# EAGLE design OLED(64x32) (EAGLE 6.5.0)
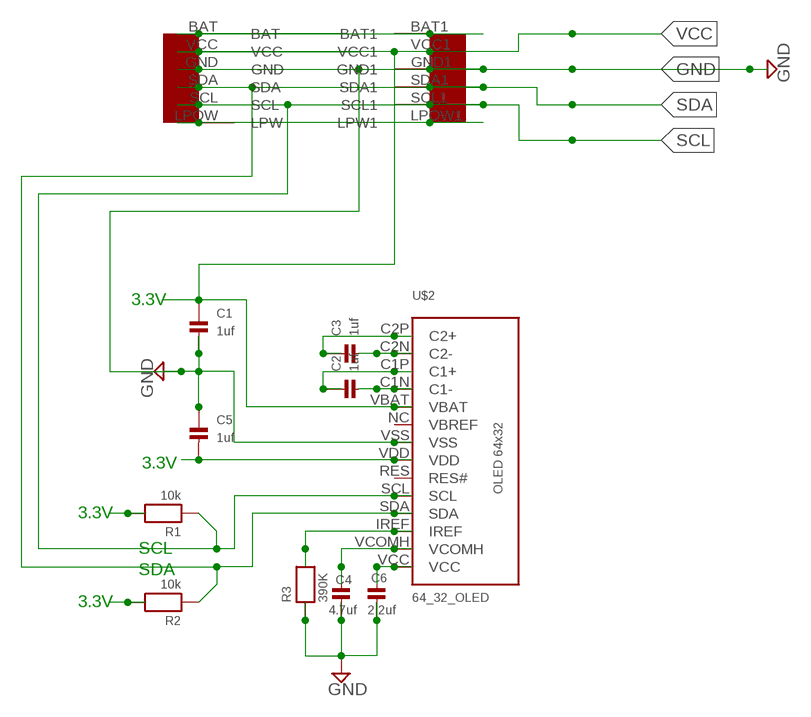
[diagram p0: schematic, sheet 1]

## Parts
C1  1uf  CAP_CERAMIC0603  [0603]
C2  1uf  CAP_CERAMIC0603  [0603]
C3  1uf  CAP_CERAMIC0603  [0603]
C4  4.7uf  CAP_CERAMIC0603  [0603]
C5  1uf  CAP_CERAMIC0603  [0603]
C6  2.2uf  CAP_CERAMIC0603  [0603]
R1  10k  RESISTOR0603  [0603]
R2  10k  RESISTOR0603  [0603]
R3  390K  RESISTOR0603  [0603]
U$1  EASYI2C6PINHEADERBLE_VERSION  [EASYI2C6HEADERBLE]
U$2  64_32_OLED  [64_32_OLED]

## Nets
BAT: U$1.BAT U$1.BAT1
GND: C1.2 C4.2 C5.1 C6.2 R3.1 U$1.GND U$1.GND1 U$2.VSS
LPW: U$1.LPOW1(LPW1) U$1.LPOW(LPW)
N$2: C2.2 U$2.C1N(C1-)
N$3: C2.1 U$2.C1P(C1+)
N$4: C3.2 U$2.C2N(C2-)
N$5: C3.1 U$2.C2P(C2+)
N$6: R3.2 U$2.IREF
N$7: C4.1 U$2.VCOMH
N$8: C6.1 U$2.VCC
SCL: R1.1 U$1.SCL U$1.SCL1 U$2.SCL
SDA: R2.1 U$1.SDA U$1.SDA1 U$2.SDA
VCC: C1.1 C5.2 R1.2 R2.2 U$1.VCC U$1.VCC1 U$2.VBAT U$2.VDD
Unconnected: U$2.NC(VBREF) U$2.RES(RES#)

## Notes on the sheet
- 3.3V
- 3.3V
- 3.3V
- SCL
- SDA
- 3.3V

## Library data of the parts
C1-C6 = microbuilder:CAP_CERAMIC: Ceramic Capacitors 0402 - 0402 Surface Mount Capacitors 16pF 50V 5% [Digikey: 445-4899-2-ND] 18pF 50V 5% [Digikey: 490-1281-2-ND] 22pF 50V 5% [Digikey: 490-1283-2-ND] 68pF 50V 5% [Digikey: 490-1289-2-ND] 0.1uF 10V 10% [Digikey: 490-1318-2-ND] 1.0uF 6.3V 10% [Digikey: 490-1320-2-ND] 0603 - 0603 Surface Mount Capacitors 16 pF 50V 5% [Digikey: 445-5051-2-ND] 22 pF 50V [Digikey: PCC220ACVTR-ND] 33 pF 50V 5% [Digikey: 490-1415-1-ND] 56pF 50V 5% [Digikey: 490-1421-1-ND] 220pF 50V 5% [Digikey: 445-1285-1-ND] 680 pF 50V 2200 pF 50V 5% C0G [Digikey: 445-1297-1-ND] 5600 pF 100V 5% X7R [Digikey: 478-3711-1-ND] 0.1 µF 25V 10% [Digikey: PCC2277TR-ND] 0.22 µF 16V 10% X7R [Digikey: 445-1318-1-ND] 1.0 µF 25V 10% [Digikey: 445-5146-2-ND] 0603 - RF Specific 3pF 250V +/-0.1pF RF [Digikey: 712-1347-1-ND] 18 pF 250V 5% [Digikey: 478-3505-1-ND or 712-1322-1-ND] 56 pF 250V 5% C0G RF [Digikey: 490-4867-1-ND] 68 pF 250V RF [Digikey: 490-4868-1-ND] 0805 - 0805 Surface Mount Capacitors 220 pF 250V 2% RF Ceramic Capacitor [Digikey: 712-1398-1-ND] 1000 pF 50V 2% NP0 Ceramic Capacitor [Digikey: 478-3760-1-ND] 0.1 µF 25V 10% Ceramic Capacitor [Digikey: PCC1828TR-ND] 1.0 µF 16V 10% Ceramic Capacitor[Digikey: 490-1691-2-ND] 10.0 µF 10V 10% Ceramic Capacitor[Digikey: 709-1228-1-ND] 10.0 uF 16V 10% Ceramic Capacitor [Digikey: 478-5165-2-ND] 47 uF 6.3V 20% Ceramic Capacitor [Digikey: 587-1779-1-ND or 399-5506-1-ND] 1206 - 1206 Surface Mount Capacitors 47uF 10V 20% Ceramic Capacitor [Digikey: 490-5528-1-ND or 399-5508-1-ND or 445-6010-1-ND] 100uF 6.3V -20%, +80% Y5V Ceramic Capacitor (Digikey: 490-4512-1-ND, Mouser: 81-GRM31CF50J107ZE1L)
R1-R3 = microbuilder:RESISTOR: Resistors 0402 - 0402 Surface Mount Package 22 Ohm 1% 1/16W [Digikey: 311-22.0LRTR-ND] 33 Ohm 5% 1/16W 1.0K 5% 1/16W 1.5K 5% 1/16W 2.0K 1% 1/16W 10.0K 1% 1/16W [Digikey: 311-10.0KLRTR-ND] 10.0K 5% 1/16W [Digikey: RMCF0402JT10K0TR-ND] 12.1K 1% 1/16W [Digikey: 311-22.0LRTR-ND] 100.0K 5% 1/16W 0603 - 0603 Surface Mount Package 0 Ohm 1/10 Watt 1% Resistor 15 Ohm 1/10 Watt 1% Resistor 33 Ohm 1/10 Watt 1% Resistor 49.9 Ohm 1/10 Watt 1% Resistor 100 Ohm 1/10 Watt 1% Resistor 150 Ohm 1/10 Watt 1% Resistor 240 Ohm 1/10 Watt 1% Resistor 390 Ohm 1/10 Watt 1% Resistor 560 Ohm 1/10 Watt 1% Resistor 680 Ohm 1/10 Watt 1% Resistor 750 Ohm 1/10 Watt 1% Resistor 1.0K Ohm 1/10 Watt 1% Resistor 1.5K Ohm 1/10 Watt 1% Resistor 2.0K Ohm 1/10 Watt 1% Resistor 2.2K Ohm 1/10 Watt 1% Resistor 3.3K Ohm 1/10 Watt 1% Resistor 4.7K Ohm 1/10 Watt 1% Resistor 10.0K Ohm 1/10 Watt 1% Resistor 12.0K Ohm 1/10 Watt 1% Resistor 12.1K Ohm 1/10 Watt 1% Resistor 20.0K Ohm 1/10 Watt 1% Resistor 33.0K Ohm 1/10 Watt 1% Resistor 100.0K Ohm 1/10 Watt 1% Resistor 0805 - 0805 Surface Mount Package 0 Ohm 1/8 Watt 1% Resistor 33 Ohm 1/8 Watt 1% Resistor 100 Ohm 1/8 Watt 1% Resistor 150 Ohm 1/8 Watt 1% Resistor 200 Ohm 1/8 Watt 1% Resistor 240 Ohm 1/8 Watt 1% Resistor 330 Ohm 1/8 Watt 1% Resistor 390 Ohm 1/8 Watt 1% Resistor 470 Ohm 1/8 Watt 1% Resistor 1.0K Ohm 1/8 Watt 1% Resistor 1.5K Ohm 1/8 Watt 1% Resistor 2.0K Ohm 1/8 Watt 1% Resistor 4.7K Ohm 1/8 Watt 1% Resistor 5.1K Ohm 1/8 Watt 1% Resistor 5.6K Ohm 1/8 Watt 1% Resistor 10.0K Ohm 1/8 Watt 1% Resistor 22.0K Ohm 1/8 Watt 1% Resistor 33.0K Ohm 1/8 Watt 1% Resistor 100K Ohm 1/8 Watt 1% Resistor 1206 - 1206 Surface Mount Package 2012 - 2010 Surface Mount Package 0.11 Ohm 1/2 Watt 1% Resistor - Digikey: RHM.11UCT-ND
U$1 = UniqueInteractionsLib:EASYI2C6PINHEADER
U$2 = UniqueInteractionsLib:64_32_OLED

## Board
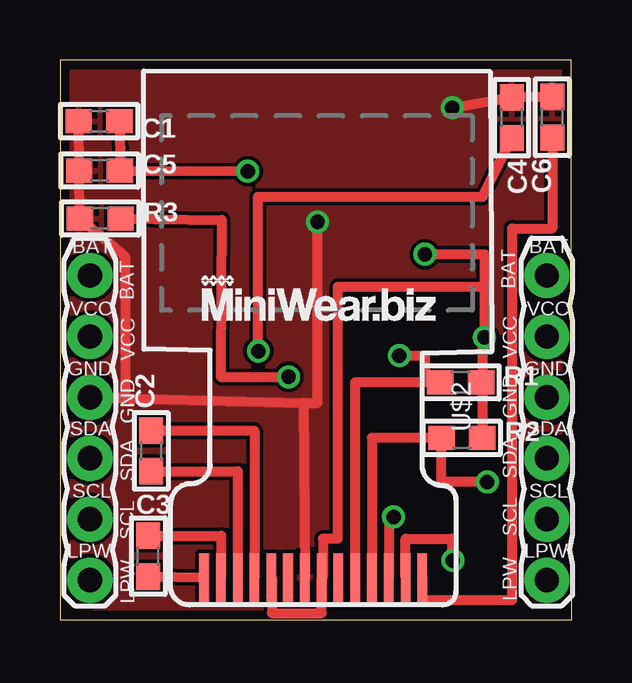
[diagram p1: board, top side]
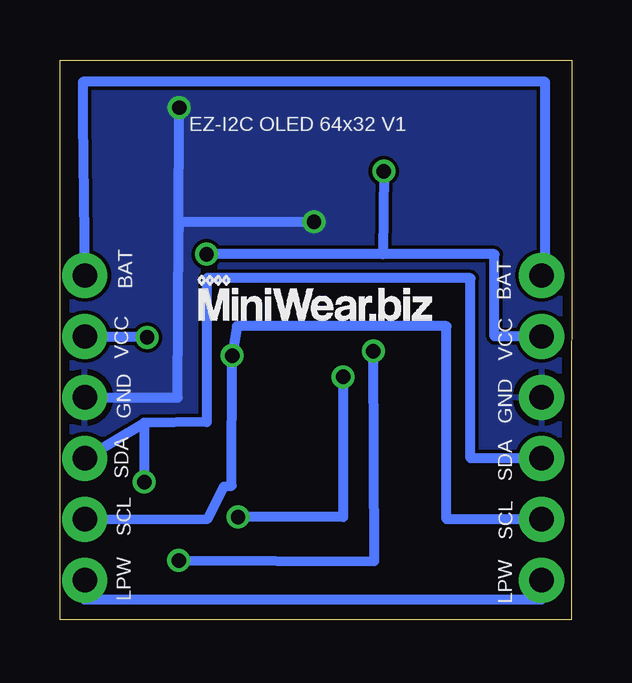
[diagram p2: board, bottom side, seen from below]

Size 21.33 x 23.35 mm. Coordinates in mm from the lower left corner, seen from the top.
Outline: 0.02,0 21.33,0.01 21.32,23.35 0,23.35 0.02,0
Copper layers (1*16): Top 0.0356mm / dielectric 1.5011mm / Bottom 0.0356mm
Design rules "oshParkPCBDesignRules": minimum track width 6mil, minimum drill 13mil, track to track 6mil, track to pad 6mil, pad to pad 6mil, via to via 6mil, smd to smd 6mil, copper to edge 15mil, drill to drill 6mil, minimum pad ring 7mil, minimum via ring 7mil, stop-mask expansion 3mil, vias tented up to drill 0mil, thermal gap 10mil

### Footprints (pad centres in the part's own frame; a part is rotated, then mirrored left to right if it is on the bottom)
0603 = smd 1.1 x 1: 1 -0.85,0; 2 0.85,0
EASYI2C6HEADERBLE = drill 1.016 pad 1.88: BAT -1.27,-1.27; BAT1 17.78,-1.27; GND -1.27,-6.35; GND1 17.78,-6.35; LPOW -1.27,-13.97; LPOW1 17.78,-13.97; SCL -1.27,-11.43; SCL1 17.78,-11.43; SDA -1.27,-8.89; SDA1 17.78,-8.89; VCC -1.27,-3.81; VCC1 17.78,-3.81
64_32_OLED = smd 2.02 x 0.4: C1N -7.67,-2.125; C1P -7.67,-2.825; C2N -7.67,-3.525; C2P -7.67,-4.225; IREF -7.67,3.475; NC -7.67,-0.725; RES -7.67,1.375; SCL -7.67,2.075; SDA -7.67,2.775; VBAT -7.67,-1.425; VCC -7.67,4.875; VCOMH -7.67,4.175; VDD -7.67,0.675; VSS -7.67,-0.025

### Placement (x,y rotation side)
C1  1.63,20.8 180 top
C2  3.81,7.05 90 top
C3  3.68,2.66 90 top
C4  18.84,20.94 90 top
C5  1.65,18.74 0 top
C6  20.53,20.96 90 top
R1  16.71,9.91 0 top
R2  16.76,7.59 0 top
R3  1.68,16.74 0 top
U$1  2.52,15.63 0 top
U$2  10.24,-5.9 270 top
U$3  [LOGO2]  15.68,12.3 0 bottom
U$6  [LOGO2]  5.8,12.29 0 top

### Tracks (layer width: path | path; a pad name or v marks a point on that pad's centre or on a via)
BAT
  Bottom 0.406: U$1.BAT 1.1,14.36 1.1,22.44 20.38,22.44 20.38,20.85 U$1.BAT1
GND  (via drill 0.6)
  Top 0.406: C6.2 18.84,21.81 C4.2 v16.36,21.36 | 10.16,9.05 U$1.GND 2.73,9.28 2.73,15.13 R3.1 C5.1 C1.2 | 10.16,9.05 U$2.VSS | 10.16,9.05 10.74,9.05 v10.74,16.6
  Bottom 0.406: U$1.GND1 16.42,9.27 16.38,16.25 | 16.38,16.25 v16.36,21.36 | v10.74,16.6 16.38,16.6 16.38,16.25
  pour Top: 0.06,23.42 21.37,23.38 21.52,-0.1 12.21,-0.14 2.82,-0.14 2.86,0.29 0.01,0.29
  pour Bottom: 0.01,0.31 2.86,0.34 2.82,-0.1 12.21,-0.1 12.25,-0.08 21.56,-0.08 21.47,23.24 0.15,23.19
LPW
  Bottom 0.406: U$1.LPOW 1.25,0.85 20.31,0.85 U$1.LPOW1
N$2
  Top 0.406: C2.2 8.11,7.9 U$2.C1N
N$3
  Top 0.406: C2.1 7.41,6.2 U$2.C1P
N$4
  Top 0.406: C3.2 6.72,3.51 U$2.C2N
N$5
  Top 0.406: C3.1 U$2.C2P
N$6  (via drill 0.6)
  Top 0.406: R3.2 6.74,16.68 6.7,10.62 6.7,10.14 v9.53,10.14 | v13.91,4.29 13.72,4.29 13.72,4.15 U$2.IREF
  Bottom 0.406: v9.53,10.14 9.53,4.29 v13.91,4.29
N$7  (via drill 0.6)
  Top 0.406: U$2.VCOMH 14.41,3.39 16.34,3.39 16.34,2.48 v16.38,2.48 | v8.27,11.21 8.25,17.65 17.62,17.65 C4.1
  Bottom 0.406: v16.38,2.48 8.23,2.45 v8.27,11.21
N$8
  Top 0.406: U$2.VCC 15.11,0.83 18.86,0.83 18.86,16.32 20.53,16.32 C6.1
SCL  (via drill 0.6)
  Top 0.406: R1.1 15.22,9.91 | 15.22,9.91 12.31,9.91 U$2.SCL | v14.15,11.02 15.22,11.02 15.22,9.91
  Bottom 0.406: U$1.SCL1 15.16,4.22 14.5,5.56 14.17,5.59 v14.15,11.02 13.95,12.25 5.22,12.25 5.22,4.2 U$1.SCL
SDA  (via drill 0.6)
  Top 0.406: U$2.SDA 13.01,7.59 R2.1 15.91,5.75 v17.82,5.75
  Bottom 0.406: U$1.SDA1 17.83,8.22 | 17.83,8.22 v17.82,5.75 | U$1.SDA 4.22,6.74 4.22,14.25 15.22,14.25 15.22,8.25 17.83,8.22
VCC  (via drill 0.6)
  Top 0.406: 17.7,13.89 11.58,13.89 11.58,3.39 10.96,3.39 10.96,1.77 U$2.VDD 10.91,0.28 8.84,0.28 8.84,1.77 U$2.VBAT | 17.61,9.91 R2.2 | 17.7,13.89 v17.7,11.78 17.61,11.78 17.61,10.25 17.61,9.91 | v15.22,15.25 17.7,15.25 17.7,13.89 | C1.1 C5.2 v7.83,18.71 | R1.2 17.61,9.91
  Bottom 0.406: U$1.VCC1 17.7,11.82 v17.7,11.78 | U$1.VCC 3.22,11.82 3.22,15.25 7.87,15.25 | 7.87,15.25 v15.22,15.25 | v7.83,18.71 7.87,15.25

### Text on the board
bNames: EZ-I2C OLED 64x32 V1